# EasyEDA Pro project HMP.eprj

# Schematic Schematic1
Create Date: 2023-10-17; Page Name: P1; Project Name: HMP; Schematic Name: Schematic1; Update Date: 2023-10-17; Company: 嘉立创EDA; Page Size: A4; Version: V1.0
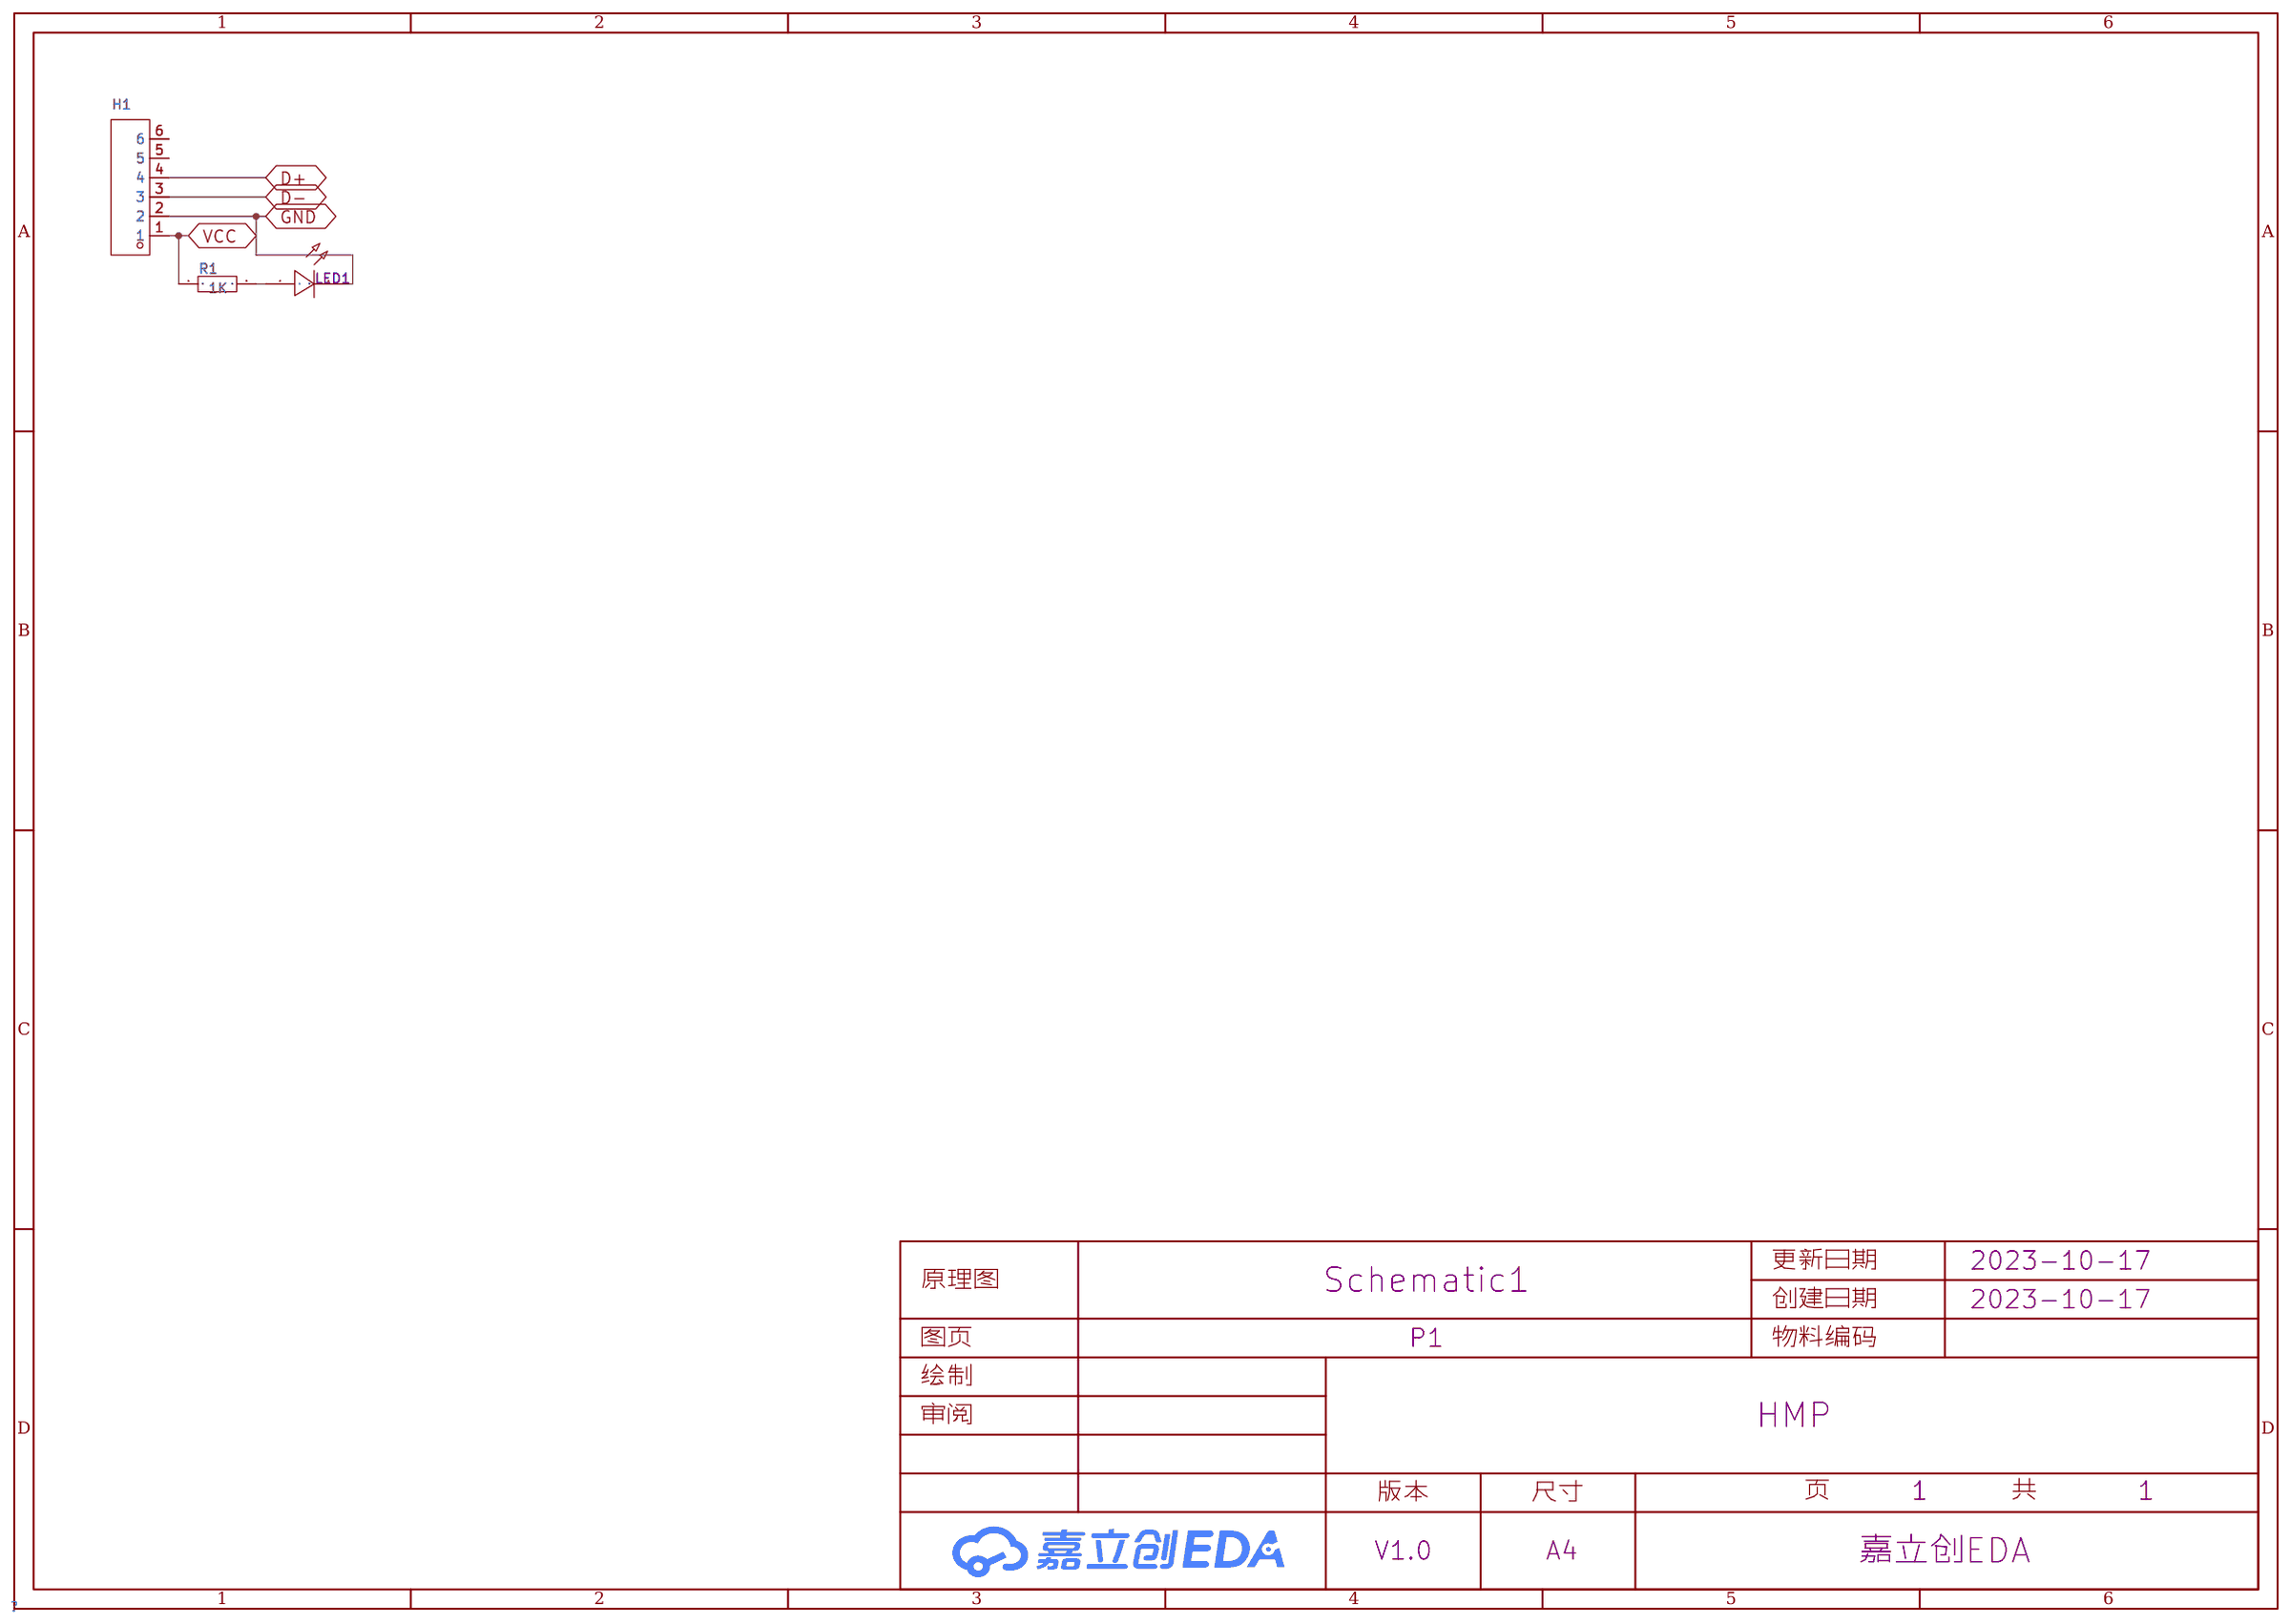
[diagram p0: schematic sheet]

## Parts
H1  -  [HDR-TH_6P-P2.54-V-F]
LED1  -  [LED_0402]
R1  1K  [R0402]

## Library data of the parts
H1 = HDR-F_2.54_1x6P: Supplier Part: C40877; Supplier Footprint: 插件
LED1 = LED_0402-G: Supplier Footprint: 0402
R1 = Res_0402: Supplier Footprint: 0402

## Nets
GND: H1.2 LED1.1(C)
VCC: H1.1 R1.1
D+: H1.4
D-: H1.3
$1N441: LED1.2(A) R1.2

Not connected (* = marked no-connect by the designer): H1 5 6

# Board PCB1
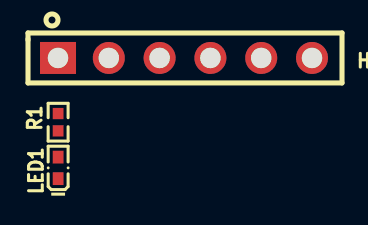
[diagram p1: board, top side]
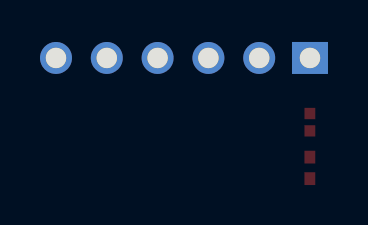
[diagram p2: board, bottom side, seen from below]

No outline. copper layers: Top Layer, Bottom Layer. Coordinates in mm from the lowest, leftmost part position.
Stack: Top Layer 0.035mm / Dielectric1 1.51mm FR4 er 4.5 / Bottom Layer 0.035mm

## Design rules (mm)
template: JLCPCB Capability(Two Layers Board)
spacing copperThickness1oz (default): track to track 0.102, other pairs 0.152 to 0.3
spacing copperThickness2oz: track to track 0.203, other pairs 0.152 to 0.3
track width copperThickness1oz (default): min 0.127, default 0.254, max 2.54
track width copperThickness2oz: min 0.203, default 0.254, max 2.54
differential pair differentialPair (default): width min 0.127, default 0.254, max 2.54; gap min 0.152, default 0.152
via viaSize (default): diameter min 0.5, default 0.61, max 10; hole min 0.3, default 0.305, max 6.3

## Placement (name value [footprint] x y rotation side)
H1  -  [HDR-TH_6P-P2.54-V-F]  6.34 5.5 0 top
LED1  -  [LED_0402]  0 0 90 top
R1  1K  [R0402]  0 2.29 270 top

## Footprints (pads in the part's own frame, mm; a bottom-side part is the same pattern mirrored in y, then rotated)
HDR-TH_6P-P2.54-V-F
  rect 1.8x1.6 hole 1.02: 1(-6.35,0)
  round 1.6 hole 1.02: 2(-3.81,0) 3(-1.27,0) 4(1.27,0) 5(3.81,0) 6(6.35,0)
LED_0402
  rect 0.637x0.541 smd: 1(-0.538,0) 2(0.538,0)
R0402
  rect 0.566x0.54 smd: 1(-0.433,0) 2(0.433,0)

## Nets
As in the schematic.

Pads without a net: H1 5 6
